# Altium schematic sheet 05021002_7-Segment Display.SchDoc: Ipê Board
size A4; Organization: Cerebra SC; Address1: R. Coriolano José Gilbertone; Address2: Jd. Paulista; Address3: n° 703; Address4: São Carlos - Brasil; DocumentNumber: 8; Revision: A; SheetNumber: 8; SheetTotal: 8
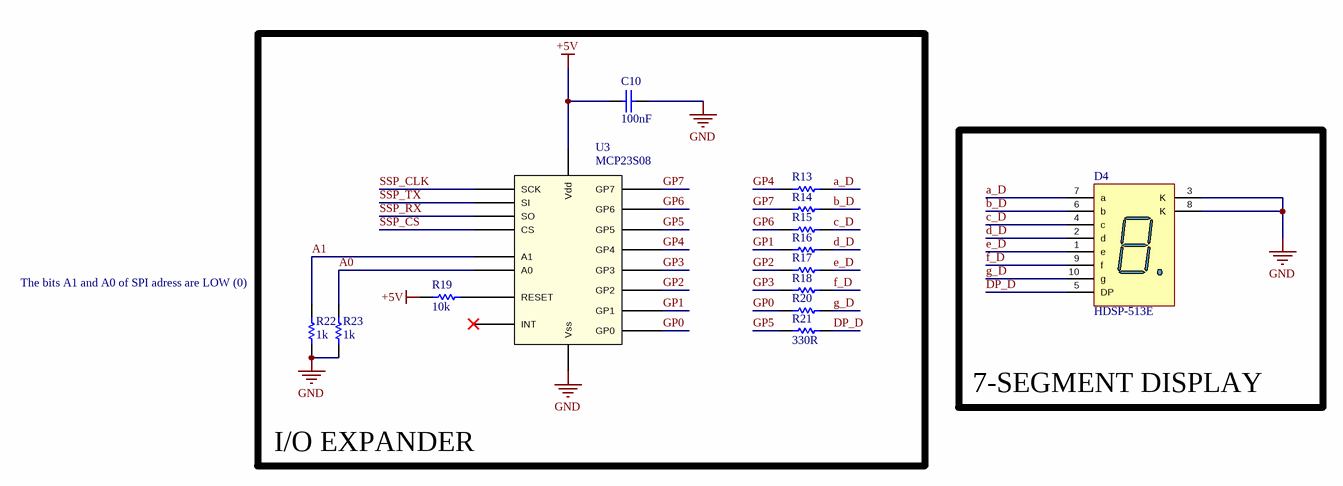
[diagram p0: 05021002_7-Segment Display.SchDoc]

## Parts
C10  100nF  [CAPC2012X135N]
D4  HDSP-513E  [HDSP-513E]
R13  330R  [0805]  (value not drawn)
R14  330R  [0805]  (value not drawn)
R15  330R  [0805]  (value not drawn)
R16  330R  [0805]  (value not drawn)
R17  330R  [0805]  (value not drawn)
R18  330R  [0805]  (value not drawn)
R19  10k  [0805]
R20  330R  [0805]  (value not drawn)
R21  330R  [0805]
R22  1k  [0805]
R23  1k  [0805]
U3  MCP23S08  [SSOP20]

## Blocks framed on the sheet
I/O EXPANDER: C10 R13-R23 U3
7-SEGMENT DISPLAY: D4

## Nets
+5V: C10.1 R19.2 U3.20(Vdd)
GND: C10.2 D4.3(K) D4.8(K) R22.1 R23.1 U3.9(Vss)
A0: R23.2 U3.5(A0)
A1: R22.2 U3.4(A1)
a_D: D4.7(a) R13.2
b_D: D4.6(b) R14.2
c_D: D4.4(c) R15.2
d_D: D4.2(d) R16.2
DP_D: D4.5(DP) R21.2
e_D: D4.1(e) R17.2
f_D: D4.9(f) R18.2
g_D: D4.10(g) R20.2
GP0: R20.1 U3.12(GP0)
GP1: R16.1 U3.13(GP1)
GP2: R17.1 U3.14(GP2)
GP3: R18.1 U3.15(GP3)
GP4: R13.1 U3.16(GP4)
GP5: R21.1 U3.17(GP5)
GP6: R15.1 U3.18(GP6)
GP7: R14.1 U3.19(GP7)
SSP_CLK: U3.1(SCK)
SSP_CS: U3.7(CS)
SSP_RX: U3.3(SO)
SSP_TX: U3.2(SI)
NetR19_1: R19.1 U3.6(RESET)

Not connected (* = marked no-connect by the designer): U3 8(INT)*

## Notes on the sheet
- The bits A1 and A0 of SPI adress are LOW (0)
- Title
- Size:
- Date:
- A4
- Number:
- Time:
- Revision:
- Sheet
- of
- File:

## Library data of the parts
C10 = capacitor_gen: Generic Capacitor; Part Number 1: 885012207016; Manufacturer 1: Wurth Electronics Inc; Value: 100nF
D4 = HDSP-513E: 14.22 mm (0.56 inch) Single Digit General Purpose Seven Segment Display; Manufacturer 1: Avago Technologies; Part Number 1: HDSP-513E
R13-R18 R20 R21 = resistor_gen: Part Number 1: RMCF0805JT330R; Manufacturer 1: Stackpole Electronics Inc.; Value: 330R
R19 = resistor_gen: Part Number 1: RMCF0805JT10K0; Manufacturer 1: Stackpole Electronics Inc.; Value: 10k
R22 R23 = resistor_gen: Part Number 1: RC0805JR-071KL; Manufacturer 1: Yageo; Value: 1k
U3 = MCP23S08: 8-Bit I/O Expander with Serial Interface; Manufacturer 1: Microchip Technology; Part Number 1: MCP23S08